# Altium project Ultrasound Smart Probe_Ver2.PrjPcb (part 9 of 9)
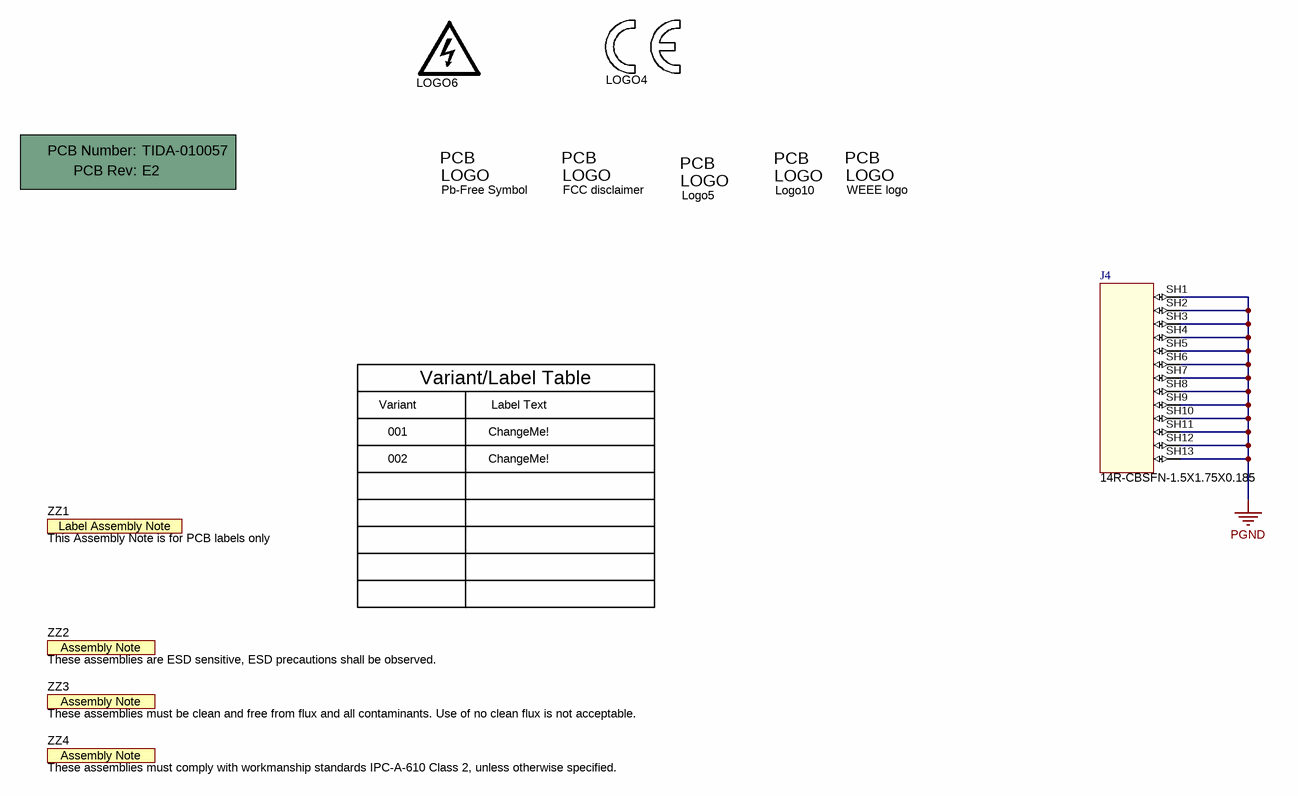
[diagram p10: EVM_Hardware.SchDoc]

## Nets that join several sheets
AVSS: Input Output Connector (26 pins), LVPS RX Supply 1V8 (C92.1 C93.1 C151.1), LVPS RX Supply 3V3 and 1V2_1 (C213.1), LVPS TX Supply 5V and m5V (C180.1 C185.2), High Voltage Power Supply (C29.2 C38.1)
GND_SIG: USB TYPE C Interface (17 pins), FX3_Interface (78 pins), Input Output Connector (62 pins), LVPS_FX3_Supply (8 pins), LVPS RX Supply 1V8 (C91.1), LVPS RX Supply 3V3 and 1V2_1 (C112.1), LVPS FPGA (5 pins)
PGND: USB TYPE C Interface (27 pins), LVPS_FX3_Supply (32 pins), LVPS RX Supply 1V8 (31 pins), LVPS RX Supply 3V3 and 1V2_1 (42 pins), LVPS FPGA (32 pins), LVPS TX Supply 5V and m5V (27 pins), High Voltage Power Supply (8 pins), EVM_Hardware (13 pins)
1.8V_AVDD: Input Output Connector (6 pins), LVPS RX Supply 1V8 (C92.2 L15.2)
1.8V_AVDD_VCA: Input Output Connector (J2.59 J2.60 J2.61 J2.62), LVPS RX Supply 1V8 (C93.2 L16.2)
1V2_DVDD: Input Output Connector (J1.19 J1.21), LVPS RX Supply 3V3 and 1V2_1 (C112.2 L41.1)
1V8_AVDD_IO_TX: Input Output Connector (J1.68 J1.70), LVPS RX Supply 1V8 (C151.2 L26.1)
1V8_DVDD: Input Output Connector (J1.47 J1.49), LVPS RX Supply 1V8 (C91.2 L14.2)
3.3V: LVPS RX Supply 1V8 (C99.1 U9.10), LVPS RX Supply 3V3 and 1V2_1 (C108.1 C109.1 L40.1 U12.1)
3.3V_AVDD: Input Output Connector (J2.65 J2.66 J2.67 J2.68), LVPS RX Supply 3V3 and 1V2_1 (C213.2 L40.2)
ALTERNATE HV INPUT: LVPS TX Supply 5V and m5V (6 pins), High Voltage Power Supply (R71.1)
CDCE_S0: FX3_Interface (U1.D2), Input Output Connector (R81.1)
CDCE_VCTRL: FX3_Interface (U1.D4), Input Output Connector (R154.1)
CLKIN_FX3: FX3_Interface (R10.1), Input Output Connector (J1.30)
DC_DC_CLK1: Input Output Connector (C78.2 J1.43 R75.2), LVPS TX Supply 5V and m5V (R120.2)
DM: USB TYPE C Interface (J3.A7 J3.B7 U18.2 U19.2), FX3_Interface (U1.A10)
DP: USB TYPE C Interface (J3.A6 J3.B6 U18.1 U19.1), FX3_Interface (U1.A9)
FPGA_PG_1V: Input Output Connector (R95.1), LVPS FPGA (R124.2 U30.14)
FPGA_PG_2V5: Input Output Connector (R234.1), LVPS FPGA (R66.2 U6.14)
FX3_A0: FX3_Interface (U1.H5), Input Output Connector (J1.7)
FX3_A1: FX3_Interface (U1.J5), Input Output Connector (J1.8)
FX3_CLK: FX3_Interface (R199.2), Input Output Connector (J2.46)
FX3_CTL15: FX3_Interface (U1.L8), Input Output Connector (J1.6)
FX3_D0: FX3_Interface (R122.2), Input Output Connector (J2.1)
FX3_D1: FX3_Interface (R192.2), Input Output Connector (J2.2)
FX3_D2: FX3_Interface (R117.2), Input Output Connector (J2.5)
FX3_D3: FX3_Interface (R169.2), Input Output Connector (J2.6)
FX3_D4: FX3_Interface (R130.2), Input Output Connector (J2.9)
FX3_D5: FX3_Interface (R194.2), Input Output Connector (J2.10)
FX3_D6: FX3_Interface (R155.2), Input Output Connector (J2.13)
FX3_D7: FX3_Interface (R193.2), Input Output Connector (J2.14)
FX3_D8: FX3_Interface (R150.2), Input Output Connector (J2.15)
FX3_D9: FX3_Interface (R196.2), Input Output Connector (J2.16)
FX3_D10: FX3_Interface (R149.2), Input Output Connector (J2.19)
FX3_D11: FX3_Interface (R197.2), Input Output Connector (J2.20)
FX3_D12: FX3_Interface (R189.2), Input Output Connector (J2.21)
FX3_D13: FX3_Interface (R125.2), Input Output Connector (J2.22)
FX3_D14: FX3_Interface (R156.2), Input Output Connector (J2.25)
FX3_D15: FX3_Interface (R243.2), Input Output Connector (J2.26)
FX3_D16: FX3_Interface (R198.2), Input Output Connector (J2.27)
FX3_D17: FX3_Interface (R244.2), Input Output Connector (J2.28)
FX3_D18: FX3_Interface (R228.2), Input Output Connector (J2.31)
FX3_D19: FX3_Interface (R227.2), Input Output Connector (J2.32)
FX3_D20: FX3_Interface (R224.2), Input Output Connector (J2.33)
FX3_D21: FX3_Interface (R217.2), Input Output Connector (J2.34)
FX3_D22: FX3_Interface (R220.2), Input Output Connector (J2.35)
FX3_D23: FX3_Interface (R216.2), Input Output Connector (J2.36)
FX3_D24: FX3_Interface (R223.2), Input Output Connector (J2.37)
FX3_D25: FX3_Interface (R218.2), Input Output Connector (J2.38)
FX3_D26: FX3_Interface (R226.2), Input Output Connector (J2.39)
FX3_D27: FX3_Interface (R219.2), Input Output Connector (J2.40)
FX3_D28: FX3_Interface (R222.2), Input Output Connector (J2.41)
FX3_D29: FX3_Interface (R221.2), Input Output Connector (J2.42)
FX3_D30: FX3_Interface (R225.2), Input Output Connector (J2.43)
FX3_D31: FX3_Interface (R240.2), Input Output Connector (J2.45)
FX3_FLAGA: FX3_Interface (U1.G7), Input Output Connector (J1.3)
FX3_FLAGB: FX3_Interface (U1.G6), Input Output Connector (J1.4)
FX3_GPO0: FX3_Interface (U1.K6), Input Output Connector (J1.11)
FX3_GPO1: FX3_Interface (U1.G5), Input Output Connector (J1.13)
FX3_GPO2: FX3_Interface (U1.H6), Input Output Connector (J1.12)
FX3_GPO3: FX3_Interface (U1.K5), Input Output Connector (J1.14)
FX3_I2C_SCL: USB TYPE C Interface (R177.2 R237.1 U22.26 U26.A1), FX3_Interface (R12.1 U1.D9 U2.6), Input Output Connector (R77.1 R157.1 SCL.1), LVPS FPGA (R233.1 U25.A1), High Voltage Power Supply (R185.1 U24.A1)
FX3_I2C_SDA: USB TYPE C Interface (R178.2 R236.1 U22.25 U26.A2), FX3_Interface (R13.1 U1.D10 U2.5), Input Output Connector (R78.1 R158.1 SDA.1), LVPS FPGA (R232.1 U25.A2), High Voltage Power Supply (R186.1 U24.A2)
FX3_INITB: FX3_Interface (R16.2), Input Output Connector (J1.28)
FX3_PG_1V2: Input Output Connector (R167.1), LVPS_FX3_Supply (R46.2 U4.14)
FX3_PG_1V8: Input Output Connector (R172.1), LVPS_FX3_Supply (R53.2 U5.14)
FX3_PKTEND: FX3_Interface (U1.H8), Input Output Connector (J1.15)
FX3_PRGB: FX3_Interface (R24.2), Input Output Connector (J1.26)
FX3_SLCS: FX3_Interface (U1.K8), Input Output Connector (J1.2)
FX3_SLOE: FX3_Interface (U1.J7), Input Output Connector (J1.1)
FX3_SLRD: FX3_Interface (U1.H7), Input Output Connector (J1.5)
FX3_SLWR: FX3_Interface (U1.K7), Input Output Connector (J1.16)
GLOBAL ENABLE: Input Output Connector (J1.44), LVPS_FX3_Supply (R47.1), LVPS RX Supply 1V8 (R92.1), LVPS RX Supply 3V3 and 1V2_1 (R63.1 R109.1), LVPS TX Supply 5V and m5V (R246.2 R247.2), High Voltage Power Supply (R245.1)
HV DISABLE: Input Output Connector (J1.40), High Voltage Power Supply (R123.1)
HVM: Input Output Connector (J1.79 J1.80), High Voltage Power Supply (C38.2 L43.2)
HVP: Input Output Connector (J2.79 J2.80), High Voltage Power Supply (C29.1 L42.2)
I2C_1V8: USB TYPE C Interface (R177.1 R178.1 R236.2 R237.2), FX3_Interface (C5.1 R12.2 R13.2 U2.8), LVPS_FX3_Supply (C123.2 L35.2), LVPS FPGA (R232.2 R233.2), High Voltage Power Supply (R185.2 R186.2)
RX_PG_1V2: Input Output Connector (R102.1), LVPS RX Supply 3V3 and 1V2_1 (R108.2 U14.14)
RX_PG_1V8: Input Output Connector (R175.1), LVPS RX Supply 1V8 (R91.2 U10.14)
RX_PG_3V3: Input Output Connector (R187.1), LVPS RX Supply 3V3 and 1V2_1 (R62.2 U11.14)
SSRXM: USB TYPE C Interface (U22.10), FX3_Interface (U1.A3)
SSRXP: USB TYPE C Interface (U22.9), FX3_Interface (U1.A4)
SSTXM: USB TYPE C Interface (U22.7), FX3_Interface (U1.A6)
SSTXP: USB TYPE C Interface (U22.6), FX3_Interface (U1.A5)
SYNC_1V2_FX3: Input Output Connector (R88.1), LVPS_FX3_Supply (C239.1)
SYNC_1V2_RX: Input Output Connector (R82.1), LVPS RX Supply 3V3 and 1V2_1 (C238.1)
SYNC_1V8_FX3: Input Output Connector (R87.1), LVPS_FX3_Supply (C240.1)
SYNC_1V8_RX: Input Output Connector (R84.1), LVPS RX Supply 1V8 (C69.1)
SYNC_3V3_RX: Input Output Connector (R83.1), LVPS RX Supply 3V3 and 1V2_1 (C237.1)
SYNC_5V_TX: Input Output Connector (R89.1), LVPS TX Supply 5V and m5V (C243.2)
SYNC_-5V_TX: Input Output Connector (U27.6), LVPS TX Supply 5V and m5V (C206.2 R120.1)
SYNC_FPGA_1V: Input Output Connector (R86.1), LVPS FPGA (C65.1)
SYNC_FPGA_2V5: Input Output Connector (R85.1), LVPS FPGA (C60.1)
SYNC_HV_TX: Input Output Connector (R160.1), High Voltage Power Supply (C28.1)
TX_5V: Input Output Connector (6 pins), LVPS TX Supply 5V and m5V (C180.2 L28.2)
TX_-5V: Input Output Connector (J1.67 J1.69), LVPS TX Supply 5V and m5V (C185.1 L34.1)
UART_RX: FX3_Interface (R17.2), Input Output Connector (J1.29)
UART_TX: FX3_Interface (U1.C2), Input Output Connector (J1.25)
VBUS: USB TYPE C Interface (16 pins), FX3_Interface (U1.E11), Input Output Connector (6 pins), LVPS_FX3_Supply (R49.2), LVPS RX Supply 1V8 (R96.2), LVPS RX Supply 3V3 and 1V2_1 (R65.2 R112.2), LVPS FPGA (5 pins), High Voltage Power Supply (5 pins)
VCC_3.3V_CDCE: USB TYPE C Interface (C202.2 C203.1 L22.1 U23.1), Input Output Connector (5 pins)
VCC_AUX_1V8: Input Output Connector (J1.20 J1.22), LVPS_FX3_Supply (C73.1 C74.2 L12.2)
VCC_FX3_AVDD: FX3_Interface (C142.1 U1.A7), LVPS_FX3_Supply (C49.1 L8.2)
VCC_FX3_CVDDQ: FX3_Interface (7 pins), LVPS_FX3_Supply (L23.2)
VCC_FX3_DVDD: FX3_Interface (19 pins), LVPS_FX3_Supply (C40.2 L7.2)
VCC_FX3_RXVDDQ: FX3_Interface (C21.2 C140.1 U1.A2), LVPS_FX3_Supply (C53.2 L10.2)
VCC_FX3_TXVDDQ: FX3_Interface (C20.2 C141.1 U1.B5), LVPS_FX3_Supply (C52.2 L9.2)
VCC_FX3_VIO: FX3_Interface (21 pins), LVPS_FX3_Supply (C55.2 L18.2)
VCC_INT_1V: Input Output Connector (J1.33 J1.34 J1.35 J1.36), LVPS FPGA (C163.2 L31.1)
VCCO_2V5: Input Output Connector (J1.48 J1.50), LVPS FPGA (C162.2 L30.1)
VDD_FPGA: LVPS_FX3_Supply (R56.2), LVPS FPGA (5 pins)
VTX_5V: LVPS TX Supply 5V and m5V (R134.2 R181.1), High Voltage Power Supply (R54.1 R145.2 R159.2 U24.D1)

## Assembly variants
001: not fitted C34 C173 R15 R18 R19 R20 R23 R30 R31 R32 R35 R47 R63 R67 R71 R75 R79 R81 R92 R109 R120 R123 R147 R153 R154 R180 R182 R188 R245 R246 R247